# EAGLE design iPod touch Cellular Uprgrade (EAGLE 5.07)
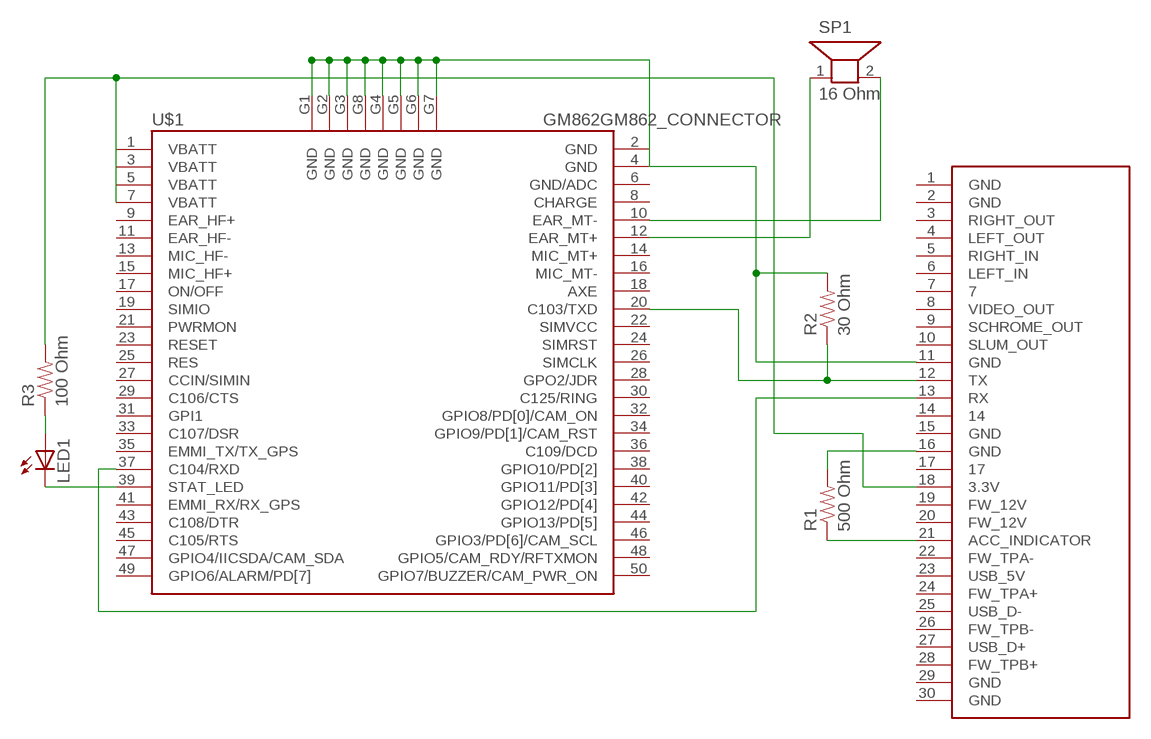
[diagram p0: schematic, sheet 1]

## Parts
LED1  LEDSMT1206  [1206]
R1  500 Ohm  RESISTOR1206  [1206]
R2  30 Ohm  RESISTOR1206  [1206]
R3  100 Ohm  RESISTOR1206  [1206]
SP1  16 Ohm  AL30P  [AL30P]
U$1  GM862GM862_CONNECTOR  [GM862_CONNECTOR]
U$2  IPOD_CONNECTOR_MALE  [IPOD_MALE_CONNECTOR]

## Nets
N$1: LED1.C U$1.39(STAT_LED)
N$2: U$1.37(C104/RXD) U$2.13(RX)
N$3: R1.2 U$2.16(GND)
N$4: R1.1 U$2.21(ACC_INDICATOR)
N$6: SP1.2 U$1.10(EAR_MT-)
N$7: SP1.1 U$1.12(EAR_MT+)
N$8: R3.2 U$1.1(VBATT) U$1.3(VBATT) U$1.5(VBATT) U$1.7(VBATT) U$2.18(3.3V)
N$10: LED1.A R3.1
N$11: R2.2 U$1.2(GND) U$1.4(GND) U$1.G1(GND) U$1.G2(GND) U$1.G3(GND) U$1.G4(GND) U$1.G5(GND) U$1.G6(GND) U$1.G7(GND) U$1.G8(GND) U$2.11(GND)
N$12: R2.1 U$1.20(C103/TXD) U$2.12(TX)
Unconnected: U$1.8(CHARGE) U$1.9(EAR_HF+) U$1.11(EAR_HF-) U$1.13(MIC_HF-) U$1.14(MIC_MT+) U$1.15(MIC_HF+) U$1.16(MIC_MT-) U$1.17(ON/OFF) U$1.18(AXE) U$1.19(SIMIO) U$1.21(PWRMON) U$1.23(RESET) U$1.24(SIMRST) U$1.25(RES) U$1.26(SIMCLK) U$1.27(CCIN/SIMIN) U$1.28(GPO2/JDR) U$1.29(C106/CTS) U$1.30(C125/RING) U$1.31(GPI1) U$1.32(GPIO8/PD[0]/CAM_ON) U$1.33(C107/DSR) U$1.34(GPIO9/PD[1]/CAM_RST) U$1.35(EMMI_TX/TX_GPS) U$1.36(C109/DCD) U$1.38(GPIO10/PD[2]) U$1.40(GPIO11/PD[3]) U$1.41(EMMI_RX/RX_GPS) U$1.42(GPIO12/PD[4]) U$1.43(C108/DTR) U$1.44(GPIO13/PD[5]) U$1.45(C105/RTS) U$1.46(GPIO3/PD[6]/CAM_SCL) U$1.47(GPIO4/IICSDA/CAM_SDA) U$1.48(GPIO5/CAM_RDY/RFTXMON) U$1.49(GPIO6/ALARM/PD[7]) U$1.50(GPIO7/BUZZER/CAM_PWR_ON) U$2.1(GND) U$2.2(GND) U$2.3(RIGHT_OUT) U$2.4(LEFT_OUT) U$2.5(RIGHT_IN) U$2.6(LEFT_IN) U$2.7 U$2.8(VIDEO_OUT) U$2.9(SCHROME_OUT) U$2.10(SLUM_OUT) U$2.14 U$2.15(GND) U$2.17 U$2.19(FW_12V) U$2.20(FW_12V) U$2.22(FW_TPA-) U$2.23(USB_5V) U$2.24(FW_TPA+) U$2.25(USB_D-) U$2.26(FW_TPB-) U$2.27(USB_D+) U$2.28(FW_TPB+) U$2.29(GND) U$2.30(GND)

## Power pins joined to a net without a drawn wire
GND/ADC: U$1.6(GND/ADC)
SIMVCC: U$1.22(SIMVCC)

## Library data of the parts
LED1 = led:LED: LED OSRAM: - CHIPLED LG R971, LG N971, LY N971, LG Q971, LY Q971, LO R971, LY R971 LH N974, LH R974 LS Q976, LO Q976, LY Q976 LO Q996 - Hyper CHIPLED LW Q18S LB Q993, LB Q99A, LB R99A - SideLED LS A670, LO A670, LY A670, LG A670, LP A670 LB A673, LV A673, LT A673, LW A673 LH A674 LY A675 LS A676, LA A676, LO A676, LY A676, LW A676 LS A679, LY A679, LG A679 - Hyper Micro SIDELED® LS Y876, LA Y876, LO Y876, LY Y876 LT Y87S - SmartLED LW L88C, LW L88S LB L89C, LB L89S, LG L890 LS L89K, LO L89K, LY L89K LS L896, LA L896, LO L896, LY L896 - TOPLED LS T670, LO T670, LY T670, LG T670, LP T670 LSG T670, LSP T670, LSY T670, LOP T670, LYG T670 LG T671, LOG T671, LSG T671 LB T673, LV T673, LT T673, LW T673 LH T674 LS T676, LA T676, LO T676, LY T676, LB T676, LH T676, LSB T676, LW T676 LB T67C, LV T67C, LT T67C, LS T67K, LO T67K, LY T67K, LW E67C LS E67B, LA E67B, LO E67B, LY E67B, LB E67C, LV E67C, LT E67C LW T67C LS T679, LY T679, LG T679 LS T770, LO T770, LY T770, LG T770, LP T770 LB T773, LV T773, LT T773, LW T773 LH T774 LS E675, LA E675, LY E675, LS T675 LS T776, LA T776, LO T776, LY T776, LB T776 LHGB T686 LT T68C, LB T68C - Hyper Mini TOPLED® LB M676 - Mini TOPLED Santana® LG M470 LS M47K, LO M47K, LY M47K Source: http://www.osram.convergy.de LUXEON: - LUMILED® LXK2-PW12-R00, LXK2-PW12-S00, LXK2-PW14-U00, LXK2-PW14-V00 LXK2-PM12-R00, LXK2-PM12-S00, LXK2-PM14-U00 LXK2-PE12-Q00, LXK2-PE12-R00, LXK2-PE12-S00, LXK2-PE14-T00, LXK2-PE14-U00 LXK2-PB12-K00, LXK2-PB12-L00, LXK2-PB12-M00, LXK2-PB14-N00, LXK2-PB14-P00, LXK2-PB14-Q00 LXK2-PR12-L00, LXK2-PR12-M00, LXK2-PR14-Q00, LXK2-PR14-R00 LXK2-PD12-Q00, LXK2-PD12-R00, LXK2-PD12-S00 LXK2-PH12-R00, LXK2-PH12-S00 LXK2-PL12-P00, LXK2-PL12-Q00, LXK2-PL12-R00 Source: www.luxeon.com KINGBRIGHT: KA-3528ASYC Source: www.kingbright.com
R1-R3 = SparkFun:RESISTOR: Resistor Basic schematic elements and footprints for 0603, 1206, and PTH 1/10th watt (small) resistors.
SP1 = buzzer:AL30P: SPEAKER Source: Buerklin
U$1 = SparkFun:GM862: GM862 Cellular Module with GPS Proven layout and schematic for GM862 cellular module with SiRF III GPS. Spark Fun Electronics SKU : CEL-07917
U$2 = SparkFun:IPOD_CONNECTOR_MALE: iPod Male Connector This is the connector that will insert into an iPods. Use this connector to gain access to the various iPod pins. Schematic and footprint are not yet production proven. The PCB thickness must be more thin than the standard 0.062" FR4. Spark Fun Electronics SKU : DEV-00633

## Board
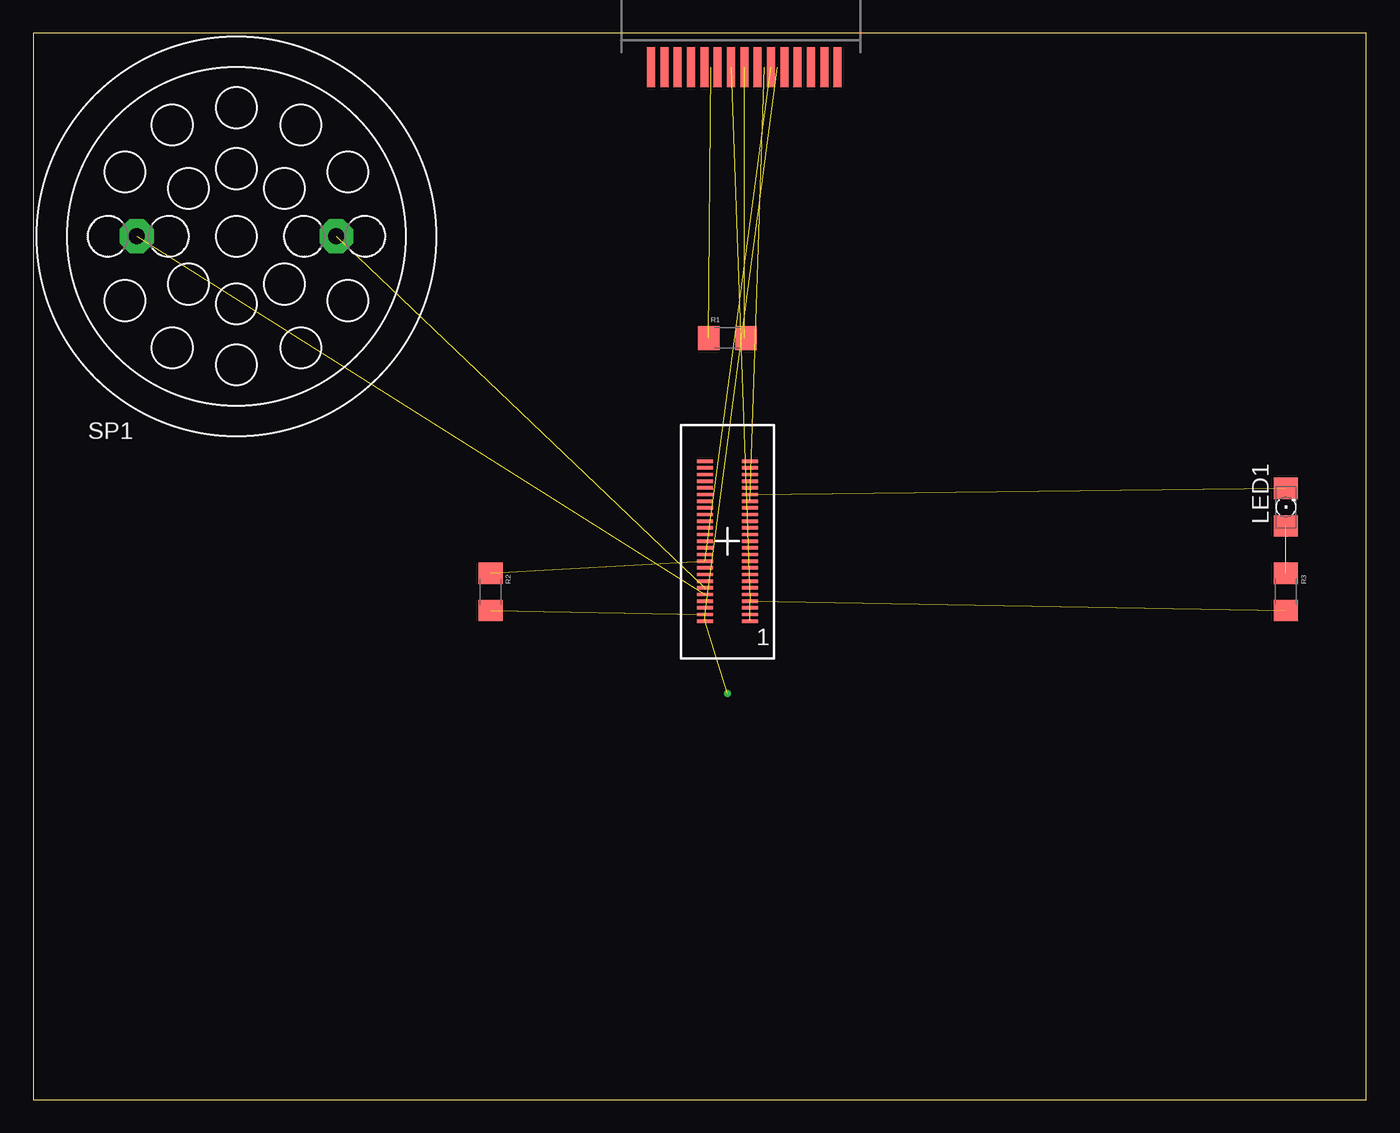
[diagram p1: board, top side]
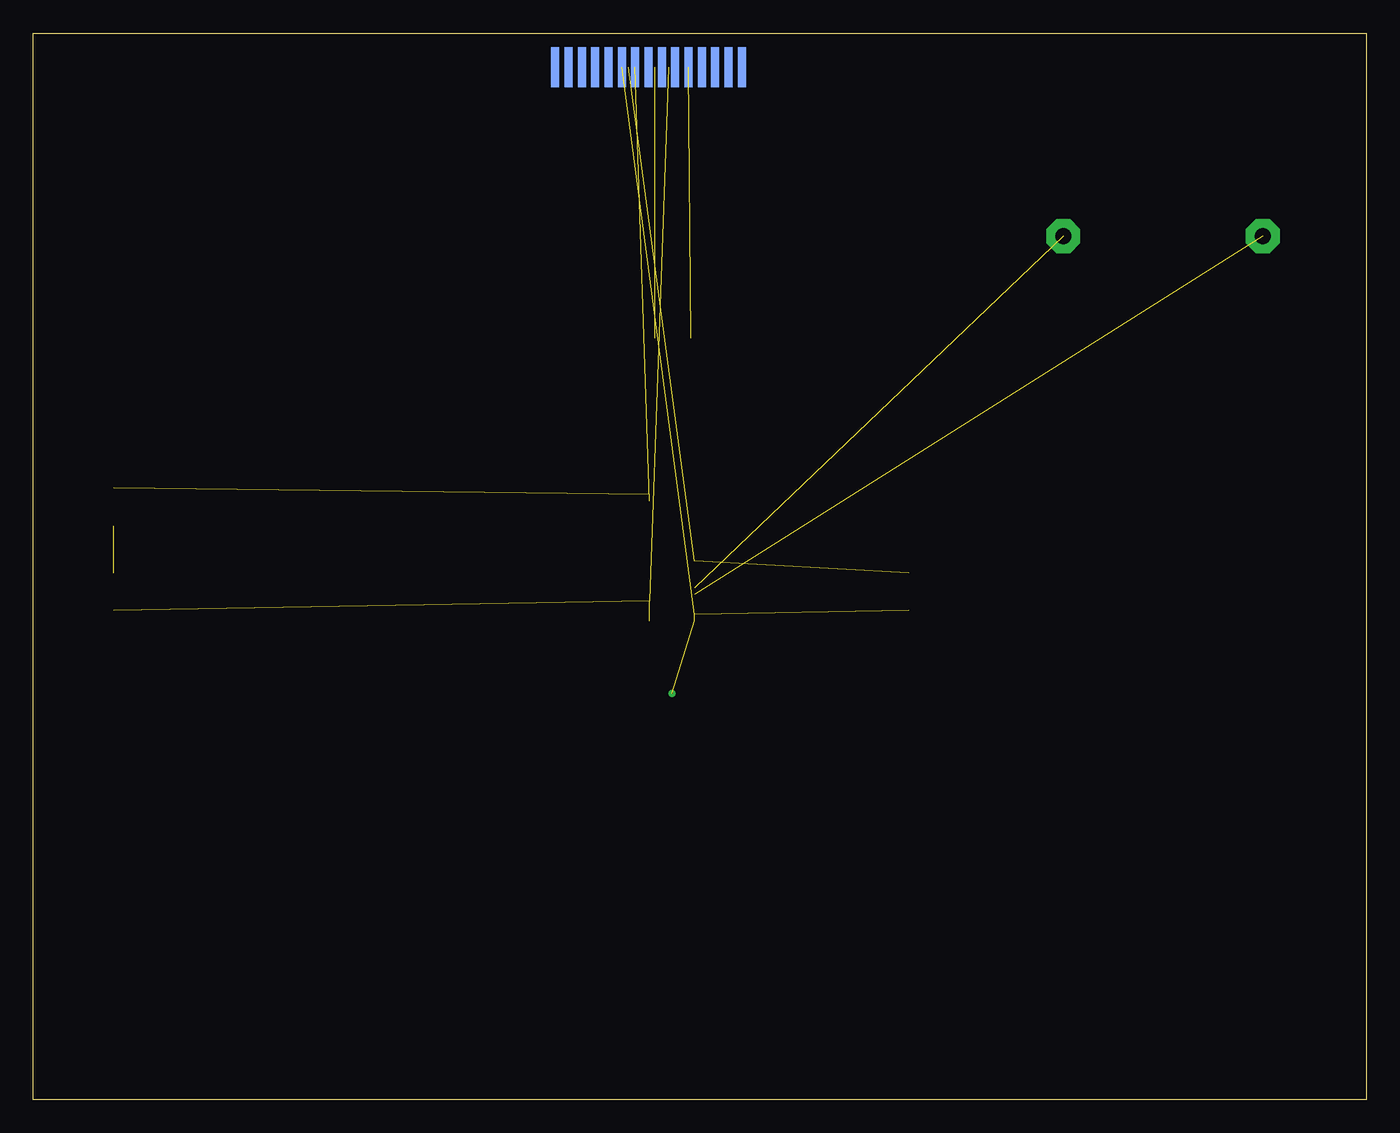
[diagram p2: board, bottom side, seen from below]

Size 100 x 80 mm. Coordinates in mm from the lower left corner, seen from the top.
Outline: 0,0 100,0 100,80 0,80 0,0
Copper layers (1*16): Top 0.035mm / dielectric 1.5mm / Bottom 0.035mm
Design rules "default": minimum track width 10mil, minimum drill 24mil, track to track 8mil, track to pad 8mil, pad to pad 8mil, via to via 8mil, smd to smd 8mil, copper to edge 40mil, drill to drill 8mil, minimum pad ring 10mil, minimum via ring 8mil, stop-mask expansion 4mil, vias tented up to drill 0mil, thermal gap 10mil

### Footprints (pad centres in the part's own frame; a part is rotated, then mirrored left to right if it is on the bottom)
1206 = smd 1.6 x 1.803: A -1.422,0; C 1.422,0
1206' = smd 1.6 x 1.8: 1 -1.4,0; 2 1.4,0
AL30P = drill 1.194 pad 2.54 octagon: 1 -7.493,0; 2 7.493,0
GM862_CONNECTOR = smd 1.2 x 0.25: 1 1.707,-6.016; 2 -1.693,-6.013; 3 1.707,-5.516; 4 -1.693,-5.513; 5 1.707,-5.016; 6 -1.693,-5.013; 7 1.707,-4.516; 8 -1.693,-4.513; 9 1.707,-4.016; 10 -1.693,-4.013; 11 1.706,-3.517; 12 -1.693,-3.513; 13 1.707,-3.016; 14 -1.693,-3.013; 15 1.707,-2.516; 16 -1.693,-2.513; 17 1.707,-2.016; 18 -1.693,-2.013; 19 1.707,-1.516; 20 -1.693,-1.513; 21 1.707,-1.016; 22 -1.693,-1.013; 23 1.707,-0.516; 24 -1.693,-0.513; 25 1.707,-0.016; 26 -1.693,-0.013; 27 1.707,0.484; 28 -1.693,0.487; 29 1.707,0.984; 30 -1.693,0.987; 31 1.707,1.484; 32 -1.693,1.487; 33 1.707,1.984; 34 -1.693,1.987; 35 1.707,2.484; 36 -1.693,2.487; 37 1.707,2.984; 38 -1.693,2.987; 39 1.707,3.484; 40 -1.693,3.487; 41 1.707,3.984; 42 -1.693,3.987; 43 1.707,4.484; 44 -1.693,4.487; 45 1.707,4.984; 46 -1.693,4.987; 47 1.707,5.484; 48 -1.693,5.487; 49 1.707,5.984; 50 -1.693,5.987 | drill 0.025 pad 0.025 round: G1 0,-11.43; G2 0,-11.43; G3 0,-11.43; G4 0,-11.43; G5 0,-11.43; G6 0,-11.43; G7 0,-11.43; G8 0,-11.43
IPOD_MALE_CONNECTOR = smd 0.6 x 3 bottom: 1 7.5,0; 3 6.5,0; 5 5.5,0; 7 4.5,0; 9 3.5,0; 11 2.5,0; 13 1.5,0; 15 0.5,0; 17 -0.5,0; 19 -1.5,0; 21 -2.5,0; 23 -3.5,0; 25 -4.5,0; 27 -5.5,0; 29 -6.5,0 | smd 0.6 x 3: 2 7,0; 4 6,0; 6 5,0; 8 4,0; 10 3,0; 12 2,0; 14 1,0; 16 0,0; 18 -1,0; 20 -2,0; 22 -3,0; 24 -4,0; 26 -5,0; 28 -6,0; 30 -7,0

### Placement (x,y rotation side)
LED1  93.98,44.45 90 top
R1  500 Ohm  [1206']  52.07,57.15 0 top
R2  30 Ohm  [1206']  34.29,38.1 270 top
R3  100 Ohm  [1206']  93.98,38.1 270 top
SP1  15.24,64.77 180 top
U$1  52.07,41.91 0 top
U$2  53.34,77.47 0 top

### Tracks (layer width: path | path; a pad name or v marks a point on that pad's centre or on a via)
N$1  (1 unrouted)
N$2  (1 unrouted)
N$3  (1 unrouted)
  Top 0.254: R1.2 53.34,57.15
N$4  (1 unrouted)
N$6  (1 unrouted)
N$7  (1 unrouted)
N$8  (5 unrouted)
N$10  (1 unrouted)
  Top 0.254: R3.1 93.98,39.37 | LED1.A 93.98,43.18
N$11  (4 unrouted)
  Top 0.254: R2.2 34.29,36.83
N$12  (2 unrouted)